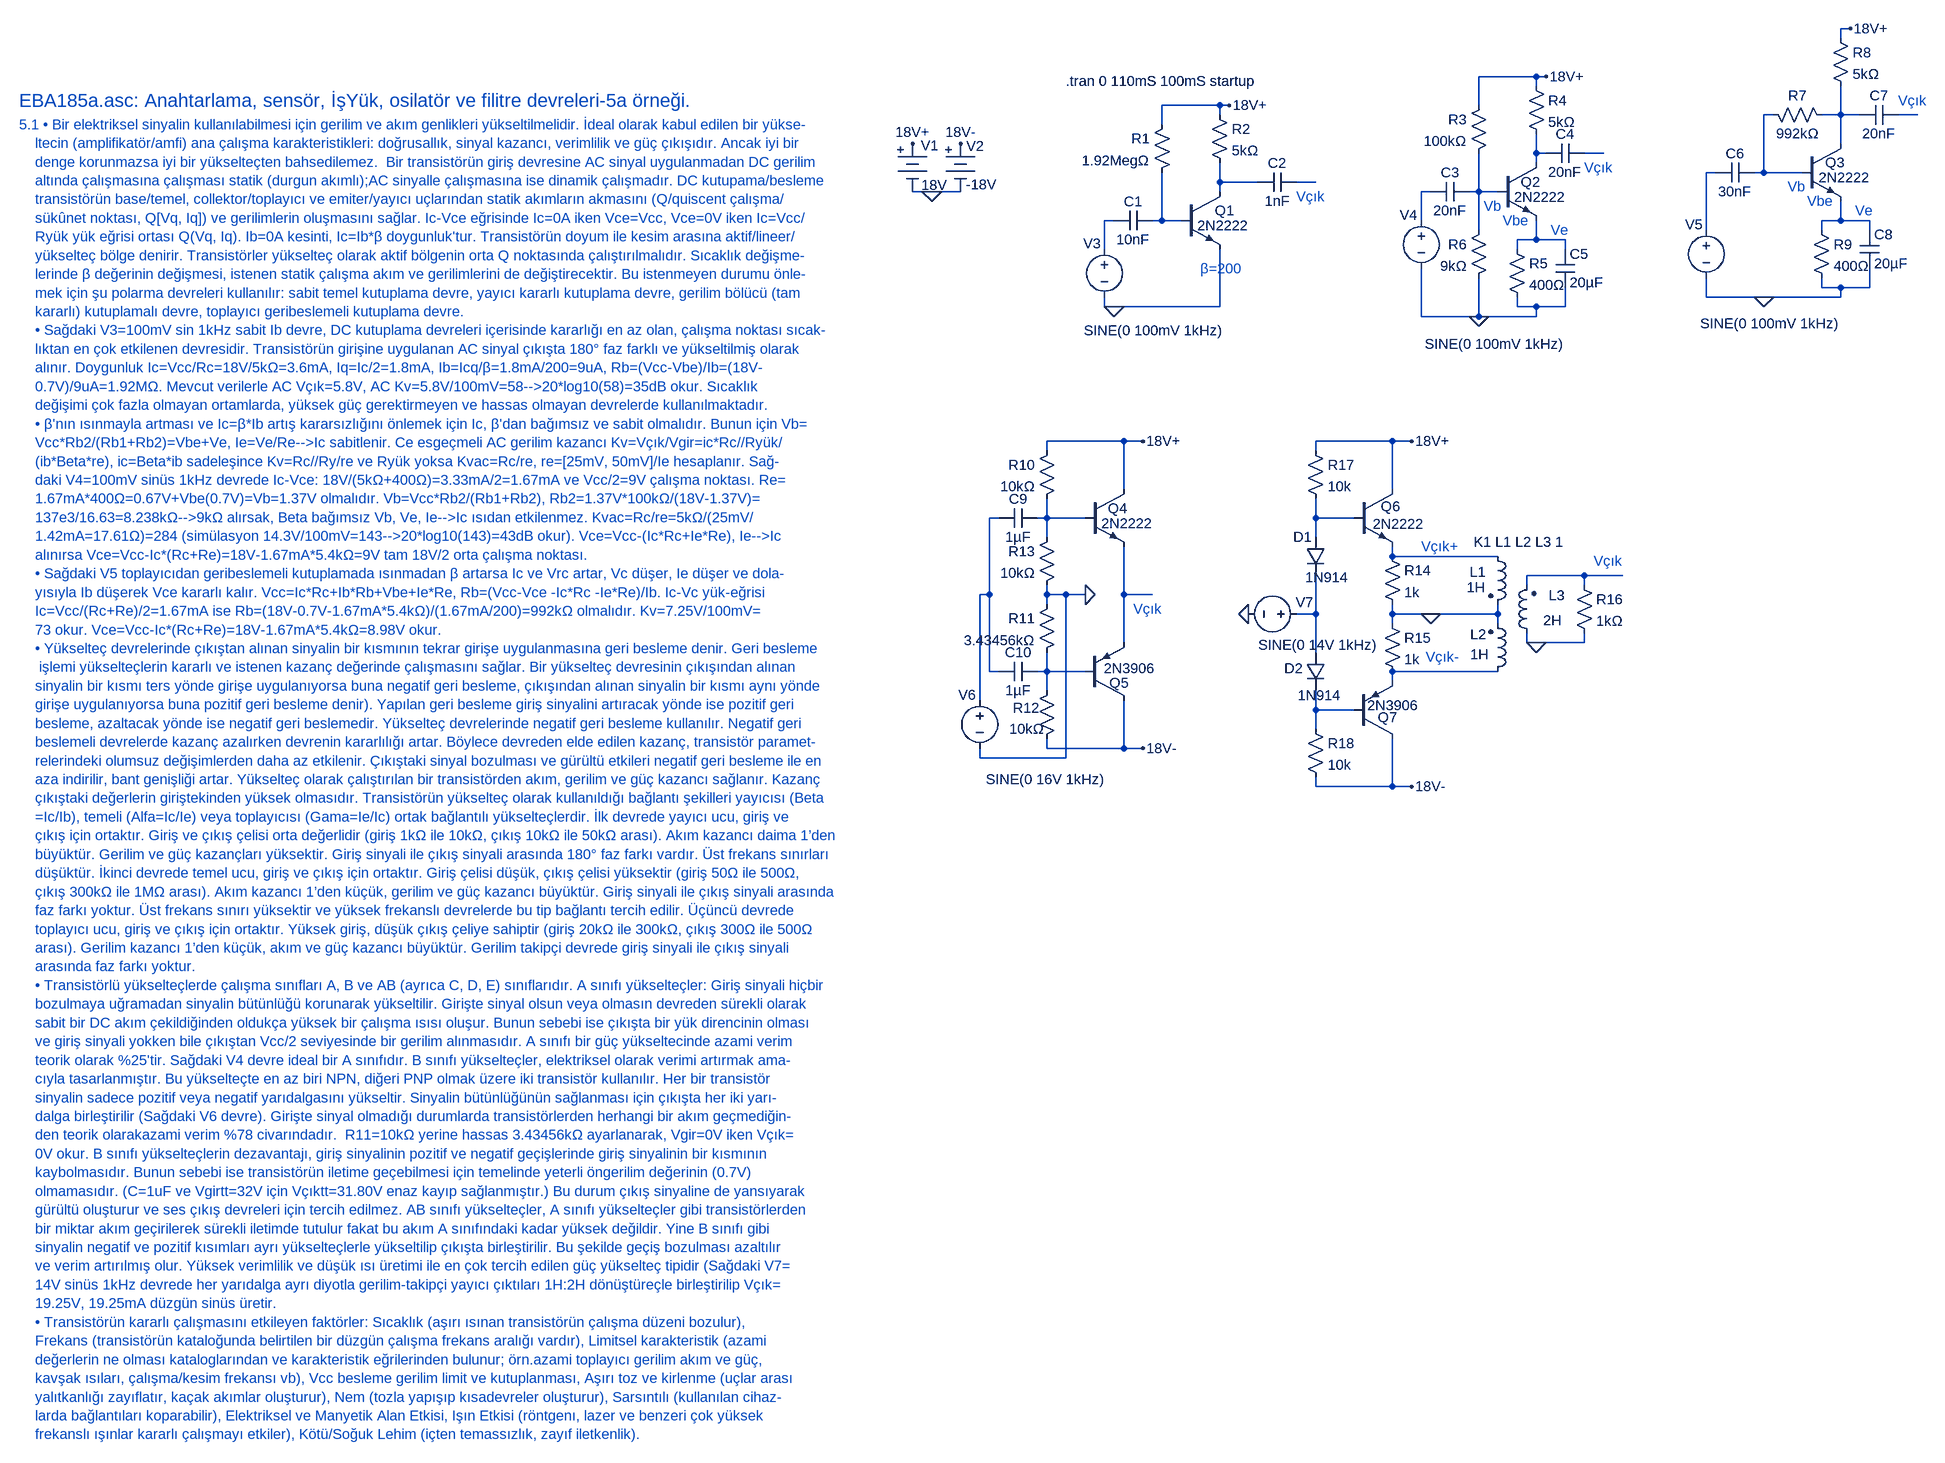
[diagram p0: schematic EBA185a.asc]
EBA185a.asc, the LTspice schematic file:
Version 4
SHEET 1 7064 4332
WIRE 3104 -64 3088 -64
WIRE 3088 -48 3088 -64
WIRE 2544 16 2448 16
WIRE 2560 16 2544 16
WIRE 2544 32 2544 16
WIRE 2016 64 1920 64
WIRE 2032 64 2016 64
WIRE 2448 64 2448 16
WIRE 2016 80 2016 64
WIRE 2976 80 2960 80
WIRE 3088 80 3088 32
WIRE 3088 80 3056 80
WIRE 3120 80 3088 80
WIRE 3216 80 3184 80
WIRE 1920 96 1920 64
WIRE 3088 128 3088 80
WIRE 2544 144 2544 112
WIRE 2560 144 2544 144
WIRE 2656 144 2624 144
WIRE 2544 160 2544 144
WIRE 2880 176 2864 176
WIRE 2960 176 2960 80
WIRE 2960 176 2944 176
WIRE 3024 176 2960 176
WIRE 2016 192 2016 160
WIRE 2080 192 2016 192
WIRE 2176 192 2144 192
WIRE 1536 208 1504 208
WIRE 1584 208 1536 208
WIRE 2016 208 2016 192
WIRE 2368 208 2352 208
WIRE 2448 208 2448 144
WIRE 2448 208 2432 208
WIRE 2480 208 2448 208
WIRE 1840 256 1824 256
WIRE 1920 256 1920 176
WIRE 1920 256 1904 256
WIRE 1952 256 1920 256
WIRE 2352 256 2352 208
WIRE 3088 256 3088 224
WIRE 3088 256 3056 256
WIRE 3136 256 3088 256
WIRE 2448 272 2448 208
WIRE 2864 272 2864 176
WIRE 3056 272 3056 256
WIRE 3136 272 3136 256
WIRE 2544 288 2544 256
WIRE 2544 288 2512 288
WIRE 2592 288 2544 288
WIRE 1824 304 1824 256
WIRE 2512 304 2512 288
WIRE 2592 304 2592 288
WIRE 3056 368 3056 352
WIRE 3088 368 3056 368
WIRE 3136 368 3136 336
WIRE 3136 368 3088 368
WIRE 2864 384 2864 352
WIRE 2960 384 2864 384
WIRE 3088 384 3088 368
WIRE 3088 384 2960 384
WIRE 1824 400 1824 384
WIRE 1840 400 1824 400
WIRE 2016 400 2016 304
WIRE 2016 400 1840 400
WIRE 2512 400 2512 384
WIRE 2544 400 2512 400
WIRE 2592 400 2592 368
WIRE 2592 400 2544 400
WIRE 2352 416 2352 336
WIRE 2448 416 2448 352
WIRE 2448 416 2352 416
WIRE 2544 416 2544 400
WIRE 2544 416 2448 416
WIRE 1856 624 1728 624
WIRE 1888 624 1856 624
WIRE 2304 624 2176 624
WIRE 2336 624 2304 624
WIRE 1728 640 1728 624
WIRE 2176 640 2176 624
WIRE 1856 704 1856 624
WIRE 2304 704 2304 624
WIRE 1648 752 1632 752
WIRE 1728 752 1728 720
WIRE 1728 752 1712 752
WIRE 1792 752 1728 752
WIRE 2176 752 2176 720
WIRE 2240 752 2176 752
WIRE 1728 784 1728 752
WIRE 2176 784 2176 752
WIRE 2304 816 2304 800
WIRE 2480 816 2304 816
WIRE 2624 848 2528 848
WIRE 2688 848 2624 848
WIRE 2528 864 2528 848
WIRE 2624 864 2624 848
WIRE 1632 880 1632 752
WIRE 1632 880 1616 880
WIRE 1728 880 1728 864
WIRE 1760 880 1728 880
WIRE 1792 880 1760 880
WIRE 1856 880 1856 800
WIRE 1904 880 1856 880
WIRE 1728 896 1728 880
WIRE 2176 912 2176 848
WIRE 2176 912 2144 912
WIRE 2304 912 2304 896
WIRE 2368 912 2304 912
WIRE 2480 912 2480 896
WIRE 2480 912 2368 912
WIRE 2304 928 2304 912
WIRE 2480 928 2480 912
WIRE 1856 960 1856 880
WIRE 2528 960 2528 944
WIRE 2544 960 2528 960
WIRE 2624 960 2624 944
WIRE 2624 960 2544 960
WIRE 2176 976 2176 912
WIRE 1632 1008 1632 880
WIRE 1648 1008 1632 1008
WIRE 1728 1008 1728 976
WIRE 1728 1008 1712 1008
WIRE 1792 1008 1728 1008
WIRE 2480 1008 2304 1008
WIRE 2304 1024 2304 1008
WIRE 1728 1040 1728 1008
WIRE 1616 1056 1616 880
WIRE 2176 1072 2176 1040
WIRE 2240 1072 2176 1072
WIRE 2176 1104 2176 1072
WIRE 1728 1136 1728 1120
WIRE 1856 1136 1856 1056
WIRE 1856 1136 1728 1136
WIRE 1888 1136 1856 1136
WIRE 1616 1152 1616 1136
WIRE 1760 1152 1760 880
WIRE 1760 1152 1616 1152
WIRE 2176 1200 2176 1184
WIRE 2304 1200 2304 1120
WIRE 2304 1200 2176 1200
WIRE 2336 1200 2304 1200
FLAG 1536 208 0
FLAG 1504 128 18V+
FLAG 1584 128 18V-
FLAG 2032 64 18V+
FLAG 1840 400 0
FLAG 2560 16 18V+
FLAG 2448 416 0
FLAG 3104 -64 18V+
FLAG 2960 384 0
FLAG 1888 624 18V+
FLAG 1792 880 0
FLAG 1888 1136 18V-
FLAG 2368 912 0
FLAG 2544 960 0
FLAG 2064 912 0
FLAG 2336 624 18V+
FLAG 2336 1200 18V-
SYMBOL Misc\\battery 1504 112 R0
WINDOW 3 15 85 Left 2
WINDOW 0 14 19 Left 2
SYMATTR Value 18V
SYMATTR InstName V1
SYMBOL Misc\\battery 1584 112 R0
WINDOW 3 9 84 Left 2
WINDOW 0 10 20 Left 2
SYMATTR Value -18V
SYMATTR InstName V2
SYMBOL npn 1952 208 R0
WINDOW 3 27 57 Left 2
SYMATTR Value 2N2222
SYMATTR InstName Q1
SYMBOL res 1936 80 M0
SYMATTR InstName R1
SYMATTR Value 1.92MegΩ
SYMBOL res 2000 64 R0
SYMATTR InstName R2
SYMATTR Value 5kΩ
SYMBOL voltage 1824 288 M0
WINDOW 0 6 7 Left 2
WINDOW 3 -196 152 Left 2
WINDOW 123 0 0 Left 0
WINDOW 39 0 0 Left 0
SYMATTR InstName V3
SYMATTR Value SINE(0 100mV 1kHz)
SYMBOL cap 1904 240 R90
WINDOW 0 0 32 VBottom 2
WINDOW 3 32 32 VTop 2
SYMATTR InstName C1
SYMATTR Value 10nF
SYMBOL cap 2144 176 R90
WINDOW 0 0 32 VBottom 2
WINDOW 3 32 32 VTop 2
SYMATTR InstName C2
SYMATTR Value 1nF
SYMBOL npn 2480 160 R0
WINDOW 3 27 57 Left 2
WINDOW 0 38 32 Left 2
SYMATTR Value 2N2222
SYMATTR InstName Q2
SYMBOL res 2464 48 M0
SYMATTR InstName R3
SYMATTR Value 100kΩ
SYMBOL res 2528 16 R0
SYMATTR InstName R4
SYMATTR Value 5kΩ
SYMBOL voltage 2352 240 M0
WINDOW 0 6 7 Left 2
WINDOW 3 -236 222 Left 2
WINDOW 123 0 0 Left 0
WINDOW 39 0 0 Left 0
SYMATTR InstName V4
SYMATTR Value SINE(0 100mV 1kHz)
SYMBOL cap 2432 192 R90
WINDOW 0 0 32 VBottom 2
WINDOW 3 32 32 VTop 2
SYMATTR InstName C3
SYMATTR Value 20nF
SYMBOL cap 2624 128 R90
WINDOW 0 0 32 VBottom 2
WINDOW 3 32 32 VTop 2
SYMATTR InstName C4
SYMATTR Value 20nF
SYMBOL res 2496 288 R0
SYMATTR InstName R5
SYMATTR Value 400Ω
SYMBOL cap 2576 304 R0
SYMATTR InstName C5
SYMATTR Value 20µF
SYMBOL res 2464 256 M0
SYMATTR InstName R6
SYMATTR Value 9kΩ
SYMBOL npn 3024 128 R0
WINDOW 3 27 57 Left 2
WINDOW 0 38 32 Left 2
SYMATTR Value 2N2222
SYMATTR InstName Q3
SYMBOL res 3072 96 M270
WINDOW 0 32 56 VTop 2
WINDOW 3 0 56 VBottom 2
SYMATTR InstName R7
SYMATTR Value 992kΩ
SYMBOL res 3072 -64 R0
SYMATTR InstName R8
SYMATTR Value 5kΩ
SYMBOL voltage 2864 256 M0
WINDOW 0 6 7 Left 2
WINDOW 3 -220 172 Left 2
WINDOW 123 0 0 Left 0
WINDOW 39 0 0 Left 0
SYMATTR InstName V5
SYMATTR Value SINE(0 100mV 1kHz)
SYMBOL cap 2944 160 R90
WINDOW 0 0 32 VBottom 2
WINDOW 3 32 32 VTop 2
SYMATTR InstName C6
SYMATTR Value 30nF
SYMBOL cap 3184 64 R90
WINDOW 0 0 32 VBottom 2
WINDOW 3 32 32 VTop 2
SYMATTR InstName C7
SYMATTR Value 20nF
SYMBOL res 3040 256 R0
SYMATTR InstName R9
SYMATTR Value 400Ω
SYMBOL cap 3120 272 R0
SYMATTR InstName C8
SYMATTR Value 20µF
SYMBOL npn 1792 704 R0
WINDOW 3 27 57 Left 2
WINDOW 0 38 32 Left 2
SYMATTR Value 2N2222
SYMATTR InstName Q4
SYMBOL res 1744 624 M0
SYMATTR InstName R10
SYMATTR Value 10kΩ
SYMBOL voltage 1616 1040 M0
WINDOW 0 6 7 Left 2
WINDOW 3 -207 148 Left 2
WINDOW 123 0 0 Left 0
WINDOW 39 0 0 Left 0
SYMATTR InstName V6
SYMATTR Value SINE(0 16V 1kHz)
SYMBOL cap 1712 736 R90
WINDOW 0 0 32 VBottom 2
WINDOW 3 32 32 VTop 2
SYMATTR InstName C9
SYMATTR Value 1µF
SYMBOL res 1744 768 M0
SYMATTR InstName R13
SYMATTR Value 10kΩ
SYMBOL pnp 1792 1056 M180
WINDOW 0 40 29 Left 2
WINDOW 3 31 53 Left 2
SYMATTR InstName Q5
SYMATTR Value 2N3906
SYMBOL res 1744 880 M0
SYMATTR InstName R11
SYMATTR Value 3.43456kΩ
SYMBOL cap 1712 992 R90
WINDOW 0 0 32 VBottom 2
WINDOW 3 32 32 VTop 2
SYMATTR InstName C10
SYMATTR Value 1µF
SYMBOL res 1744 1024 M0
WINDOW 0 28 45 Left 2
WINDOW 3 21 80 Left 2
SYMATTR InstName R12
SYMATTR Value 10kΩ
SYMBOL npn 2240 704 R0
WINDOW 0 45 29 Left 2
WINDOW 3 31 58 Left 2
SYMATTR InstName Q6
SYMATTR Value 2N2222
SYMBOL pnp 2240 1120 M180
WINDOW 0 40 35 Left 2
WINDOW 3 22 55 Left 2
SYMATTR InstName Q7
SYMATTR Value 2N3906
SYMBOL voltage 2160 912 R90
WINDOW 3 52 -117 VRight 2
WINDOW 123 0 0 Left 0
WINDOW 39 0 0 Left 0
WINDOW 0 -19 -12 VRight 2
SYMATTR Value SINE(0 14V 1kHz)
SYMATTR InstName V7
SYMBOL diode 2192 784 M0
WINDOW 3 -38 67 Left 2
WINDOW 0 22 0 Left 2
SYMATTR Value 1N914
SYMATTR InstName D1
SYMBOL diode 2192 976 M0
WINDOW 3 -26 72 Left 2
WINDOW 0 37 27 Left 2
SYMATTR Value 1N914
SYMATTR InstName D2
SYMBOL res 2288 800 R0
SYMATTR InstName R14
SYMATTR Value 1k
SYMBOL res 2288 912 R0
SYMATTR InstName R15
SYMATTR Value 1k
SYMBOL ind2 2464 800 R0
WINDOW 0 -31 42 Left 2
WINDOW 3 -36 68 Left 2
SYMATTR InstName L1
SYMATTR Value 1H
SYMATTR Type ind
SYMBOL ind2 2464 1024 M180
WINDOW 0 -30 78 Left 2
WINDOW 3 -30 44 Left 2
SYMATTR InstName L2
SYMATTR Value 1H
SYMATTR Type ind
SYMBOL ind2 2544 960 R180
WINDOW 0 -48 79 Left 2
WINDOW 3 -42 37 Left 2
SYMATTR InstName L3
SYMATTR Value 2H
SYMATTR Type ind
SYMBOL res 2608 848 R0
SYMATTR InstName R16
SYMATTR Value 1kΩ
SYMBOL res 2160 624 R0
SYMATTR InstName R17
SYMATTR Value 10k
SYMBOL res 2160 1088 R0
SYMATTR InstName R18
SYMATTR Value 10k
TEXT -232 56 Left 3 ;EBA185a.asc: Anahtarlama, sensör, İşYük, osilatör ve filitre devreleri-5a örneği.
TEXT -232 96 Left 2 ;5.1 • Bir elektriksel sinyalin kullanılabilmesi için gerilim ve akım genlikleri yükseltilmelidir. İdeal olarak kabul edilen bir yükse-\n    ltecin (amplifikatör/amfi) ana çalışma karakteristikleri: doğrusallık, sinyal kazancı, verimlilik ve güç çıkışıdır. Ancak iyi bir\n    denge korunmazsa iyi bir yükselteçten bahsedilemez.  Bir transistörün giriş devresine AC sinyal uygulanmadan DC gerilim\n    altında çalışmasına çalışması statik (durgun akımlı);AC sinyalle çalışmasına ise dinamik çalışmadır. DC kutupama/besleme\n    transistörün base/temel, collektor/toplayıcı ve emiter/yayıcı uçlarından statik akımların akmasını (Q/quiscent çalışma/\n    sükûnet noktası, Q[Vq, Iq]) ve gerilimlerin oluşmasını sağlar. Ic-Vce eğrisinde Ic=0A iken Vce=Vcc, Vce=0V iken Ic=Vcc/\n    Ryük yük eğrisi ortası Q(Vq, Iq). Ib=0A kesinti, Ic=Ib*β doygunluk'tur. Transistörün doyum ile kesim arasına aktif/lineer/\n    yükselteç bölge denirir. Transistörler yükselteç olarak aktif bölgenin orta Q noktasında çalıştırılmalıdır. Sıcaklık değişme-\n    lerinde β değerinin değişmesi, istenen statik çalışma akım ve gerilimlerini de değiştirecektir. Bu istenmeyen durumu önle-\n    mek için şu polarma devreleri kullanılır: sabit temel kutuplama devre, yayıcı kararlı kutuplama devre, gerilim bölücü (tam \n    kararlı) kutuplamalı devre, toplayıcı geribeslemeli kutuplama devre.\n    • Sağdaki V3=100mV sin 1kHz sabit Ib devre, DC kutuplama devreleri içerisinde kararlığı en az olan, çalışma noktası sıcak-\n    lıktan en çok etkilenen devresidir. Transistörün girişine uygulanan AC sinyal çıkışta 180° faz farklı ve yükseltilmiş olarak \n    alınır. Doygunluk Ic=Vcc/Rc=18V/5kΩ=3.6mA, Iq=Ic/2=1.8mA, Ib=Icq/β=1.8mA/200=9uA, Rb=(Vcc-Vbe)/Ib=(18V-\n    0.7V)/9uA=1.92MΩ. Mevcut verilerle AC Vçık=5.8V, AC Kv=5.8V/100mV=58-->20*log10(58)=35dB okur. Sıcaklık \n    değişimi çok fazla olmayan ortamlarda, yüksek güç gerektirmeyen ve hassas olmayan devrelerde kullanılmaktadır.\n    • β'nın ısınmayla artması ve Ic=β*Ib artış kararsızlığını önlemek için Ic, β'dan bağımsız ve sabit olmalıdır. Bunun için Vb=\n    Vcc*Rb2/(Rb1+Rb2)=Vbe+Ve, Ie=Ve/Re-->Ic sabitlenir. Ce esgeçmeli AC gerilim kazancı Kv=Vçık/Vgir=ic*Rc//Ryük/\n    (ib*Beta*re), ic=Beta*ib sadeleşince Kv=Rc//Ry/re ve Ryük yoksa Kvac=Rc/re, re=[25mV, 50mV]/Ie hesaplanır. Sağ-\n    daki V4=100mV sinüs 1kHz devrede Ic-Vce: 18V/(5kΩ+400Ω)=3.33mA/2=1.67mA ve Vcc/2=9V çalışma noktası. Re=\n    1.67mA*400Ω=0.67V+Vbe(0.7V)=Vb=1.37V olmalıdır. Vb=Vcc*Rb2/(Rb1+Rb2), Rb2=1.37V*100kΩ/(18V-1.37V)=\n    137e3/16.63=8.238kΩ-->9kΩ alırsak, Beta bağımsız Vb, Ve, Ie-->Ic ısıdan etkilenmez. Kvac=Rc/re=5kΩ/(25mV/\n    1.42mA=17.61Ω)=284 (simülasyon 14.3V/100mV=143-->20*log10(143)=43dB okur). Vce=Vcc-(Ic*Rc+Ie*Re), Ie-->Ic\n    alınırsa Vce=Vcc-Ic*(Rc+Re)=18V-1.67mA*5.4kΩ=9V tam 18V/2 orta çalışma noktası.\n    • Sağdaki V5 toplayıcıdan geribeslemeli kutuplamada ısınmadan β artarsa Ic ve Vrc artar, Vc düşer, Ie düşer ve dola-\n    yısıyla Ib düşerek Vce kararlı kalır. Vcc=Ic*Rc+Ib*Rb+Vbe+Ie*Re, Rb=(Vcc-Vce -Ic*Rc -Ie*Re)/Ib. Ic-Vc yük-eğrisi \n    Ic=Vcc/(Rc+Re)/2=1.67mA ise Rb=(18V-0.7V-1.67mA*5.4kΩ)/(1.67mA/200)=992kΩ olmalıdır. Kv=7.25V/100mV=\n    73 okur. Vce=Vcc-Ic*(Rc+Re)=18V-1.67mA*5.4kΩ=8.98V okur.\n    • Yükselteç devrelerinde çıkıştan alınan sinyalin bir kısmının tekrar girişe uygulanmasına geri besleme denir. Geri besleme\n     işlemi yükselteçlerin kararlı ve istenen kazanç değerinde çalışmasını sağlar. Bir yükselteç devresinin çıkışından alınan \n    sinyalin bir kısmı ters yönde girişe uygulanıyorsa buna negatif geri besleme, çıkışından alınan sinyalin bir kısmı aynı yönde\n    girişe uygulanıyorsa buna pozitif geri besleme denir). Yapılan geri besleme giriş sinyalini artıracak yönde ise pozitif geri\n    besleme, azaltacak yönde ise negatif geri beslemedir. Yükselteç devrelerinde negatif geri besleme kullanılır. Negatif geri \n    beslemeli devrelerde kazanç azalırken devrenin kararlılığı artar. Böylece devreden elde edilen kazanç, transistör paramet-\n    relerindeki olumsuz değişimlerden daha az etkilenir. Çıkıştaki sinyal bozulması ve gürültü etkileri negatif geri besleme ile en \n    aza indirilir, bant genişliği artar. Yükselteç olarak çalıştırılan bir transistörden akım, gerilim ve güç kazancı sağlanır. Kazanç \n    çıkıştaki değerlerin giriştekinden yüksek olmasıdır. Transistörün yükselteç olarak kullanıldığı bağlantı şekilleri yayıcısı (Beta\n    =Ic/Ib), temeli (Alfa=Ic/Ie) veya toplayıcısı (Gama=Ie/Ic) ortak bağlantılı yükselteçlerdir. İlk devrede yayıcı ucu, giriş ve \n    çıkış için ortaktır. Giriş ve çıkış çelisi orta değerlidir (giriş 1kΩ ile 10kΩ, çıkış 10kΩ ile 50kΩ arası). Akım kazancı daima 1’den\n    büyüktür. Gerilim ve güç kazançları yüksektir. Giriş sinyali ile çıkış sinyali arasında 180° faz farkı vardır. Üst frekans sınırları \n    düşüktür. İkinci devrede temel ucu, giriş ve çıkış için ortaktır. Giriş çelisi düşük, çıkış çelisi yüksektir (giriş 50Ω ile 500Ω, \n    çıkış 300kΩ ile 1MΩ arası). Akım kazancı 1’den küçük, gerilim ve güç kazancı büyüktür. Giriş sinyali ile çıkış sinyali arasında \n    faz farkı yoktur. Üst frekans sınırı yüksektir ve yüksek frekanslı devrelerde bu tip bağlantı tercih edilir. Üçüncü devrede \n    toplayıcı ucu, giriş ve çıkış için ortaktır. Yüksek giriş, düşük çıkış çeliye sahiptir (giriş 20kΩ ile 300kΩ, çıkış 300Ω ile 500Ω \n    arası). Gerilim kazancı 1’den küçük, akım ve güç kazancı büyüktür. Gerilim takipçi devrede giriş sinyali ile çıkış sinyali\n    arasında faz farkı yoktur.\n    • Transistörlü yükselteçlerde çalışma sınıfları A, B ve AB (ayrıca C, D, E) sınıflarıdır. A sınıfı yükselteçler: Giriş sinyali hiçbir \n    bozulmaya uğramadan sinyalin bütünlüğü korunarak yükseltilir. Girişte sinyal olsun veya olmasın devreden sürekli olarak \n    sabit bir DC akım çekildiğinden oldukça yüksek bir çalışma ısısı oluşur. Bunun sebebi ise çıkışta bir yük direncinin olması\n    ve giriş sinyali yokken bile çıkıştan Vcc/2 seviyesinde bir gerilim alınmasıdır. A sınıfı bir güç yükseltecinde azami verim \n    teorik olarak %25'tir. Sağdaki V4 devre ideal bir A sınıfıdır. B sınıfı yükselteçler, elektriksel olarak verimi artırmak ama-\n    cıyla tasarlanmıştır. Bu yükselteçte en az biri NPN, diğeri PNP olmak üzere iki transistör kullanılır. Her bir transistör \n    sinyalin sadece pozitif veya negatif yarıdalgasını yükseltir. Sinyalin bütünlüğünün sağlanması için çıkışta her iki yarı-\n    dalga birleştirilir (Sağdaki V6 devre). Girişte sinyal olmadığı durumlarda transistörlerden herhangi bir akım geçmediğin-\n    den teorik olarakazami verim %78 civarındadır.  R11=10kΩ yerine hassas 3.43456kΩ ayarlanarak, Vgir=0V iken Vçık=\n    0V okur. B sınıfı yükselteçlerin dezavantajı, giriş sinyalinin pozitif ve negatif geçişlerinde giriş sinyalinin bir kısmının \n    kaybolmasıdır. Bunun sebebi ise transistörün iletime geçebilmesi için temelinde yeterli öngerilim değerinin (0.7V) \n    olmamasıdır. (C=1uF ve Vgirtt=32V için Vçıktt=31.80V enaz kayıp sağlanmıştır.) Bu durum çıkış sinyaline de yansıyarak \n    gürültü oluşturur ve ses çıkış devreleri için tercih edilmez. AB sınıfı yükselteçler, A sınıfı yükselteçler gibi transistörlerden \n    bir miktar akım geçirilerek sürekli iletimde tutulur fakat bu akım A sınıfındaki kadar yüksek değildir. Yine B sınıfı gibi\n    sinyalin negatif ve pozitif kısımları ayrı yükselteçlerle yükseltilip çıkışta birleştirilir. Bu şekilde geçiş bozulması azaltılır \n    ve verim artırılmış olur. Yüksek verimlilik ve düşük ısı üretimi ile en çok tercih edilen güç yükselteç tipidir (Sağdaki V7=\n    14V sinüs 1kHz devrede her yarıdalga ayrı diyotla gerilim-takipçi yayıcı çıktıları 1H:2H dönüştüreçle birleştirilip Vçık=\n    19.25V, 19.25mA düzgün sinüs üretir.\n    • Transistörün kararlı çalışmasını etkileyen faktörler: Sıcaklık (aşırı ısınan transistörün çalışma düzeni bozulur), \n    Frekans (transistörün kataloğunda belirtilen bir düzgün çalışma frekans aralığı vardır), Limitsel karakteristik (azami \n    değerlerin ne olması kataloglarından ve karakteristik eğrilerinden bulunur; örn.azami toplayıcı gerilim akım ve güç, \n    kavşak ısıları, çalışma/kesim frekansı vb), Vcc besleme gerilim limit ve kutuplanması, Aşırı toz ve kirlenme (uçlar arası\n    yalıtkanlığı zayıflatır, kaçak akımlar oluşturur), Nem (tozla yapışıp kısadevreler oluşturur), Sarsıntılı (kullanılan cihaz-\n    larda bağlantıları koparabilir), Elektriksel ve Manyetik Alan Etkisi, Işın Etkisi (röntgenı, lazer ve benzeri çok yüksek \n    frekanslı ışınlar kararlı çalışmayı etkiler), Kötü/Soğuk Lehim (içten temassızlık, zayıf iletkenlik).
TEXT 1984 336 Left 2 ;β=200
TEXT 1760 24 Left 2 !.tran 0 110mS 100mS startup
TEXT 2144 216 Left 2 ;Vçık
TEXT 2624 168 Left 2 ;Vçık
TEXT 2456 232 Left 2 ;Vb
TEXT 2568 272 Left 2 ;Ve
TEXT 2488 256 Left 2 ;Vbe
TEXT 3184 56 Left 2 ;Vçık
TEXT 3000 200 Left 2 ;Vb
TEXT 3112 240 Left 2 ;Ve
TEXT 3032 224 Left 2 ;Vbe
TEXT 1872 904 Left 2 ;Vçık
TEXT 2640 824 Left 2 ;Vçık
TEXT 2440 792 Left 2 !K1 L1 L2 L3 1
TEXT 2352 800 Left 2 ;Vçık+
TEXT 2360 984 Left 2 ;Vçık-

The netlist it stands for:
* EBA185a.asc
V1 18V+ 0 18V
V2 18V- 0 -18V
Q1 N007 N012 0 0 2N2222
R1 18V+ N012 1.92MegΩ
R2 18V+ N007 5kΩ
V3 N011 0 SINE(0 100mV 1kHz)
C1 N012 N011 10nF
C2 N008 N007 1nF
Q2 N004 N010 N014 0 2N2222
R3 18V+ N010 100kΩ
R4 18V+ N004 5kΩ
V4 N009 0 SINE(0 100mV 1kHz)
C3 N010 N009 20nF
C4 N005 N004 20nF
R5 N014 0 400Ω
C5 N014 0 20µF
R6 N010 0 9kΩ
Q3 N002 N001 N013 0 2N2222
R7 N002 N001 992kΩ
R8 18V+ N002 5kΩ
V5 N006 0 SINE(0 100mV 1kHz)
C6 N001 N006 30nF
C7 N003 N002 20nF
R9 N013 0 400Ω
C8 N013 0 20µF
Q4 18V+ N016 N020 0 2N2222
R10 18V+ N016 10kΩ
V6 N015 0 SINE(0 16V 1kHz)
C9 N016 N015 1µF
R13 N016 0 10kΩ
Q5 18V- N022 N020 0 2N3906
R11 0 N022 3.43456kΩ
C10 N022 N015 1µF
R12 N022 18V- 10kΩ
Q6 18V+ N017 N018 0 2N2222
Q7 18V- N024 N023 0 2N3906
V7 N021 0 SINE(0 14V 1kHz)
D1 N017 N021 1N914
D2 N021 N024 1N914
R14 N018 0 1k
R15 0 N023 1k
L1 N018 0 1H
L2 N023 0 1H
L3 0 N019 2H
R16 N019 0 1kΩ
R17 18V+ N017 10k
R18 N024 18V- 10k
.model D D
.lib standard.dio
.model NPN NPN
.model PNP PNP
.lib standard.bjt
* EBA185a.asc: Anahtarlama, sensör, İşYük, osilatör ve filitre devreleri-5a örneği.
* 5.1 • Bir elektriksel sinyalin kullanılabilmesi için gerilim ve akım genlikleri yükseltilmelidir. İdeal olarak kabul edilen bir yükse-
*     ltecin (amplifikatör/amfi) ana çalışma karakteristikleri: doğrusallık, sinyal kazancı, verimlilik ve güç çıkışıdır. Ancak iyi bir
*     denge korunmazsa iyi bir yükselteçten bahsedilemez.  Bir transistörün giriş devresine AC sinyal uygulanmadan DC gerilim
*     altında çalışmasına çalışması statik (durgun akımlı);AC sinyalle çalışmasına ise dinamik çalışmadır. DC kutupama/besleme
*     transistörün base/temel, collektor/toplayıcı ve emiter/yayıcı uçlarından statik akımların akmasını (Q/quiscent çalışma/
*     sükûnet noktası, Q[Vq, Iq]) ve gerilimlerin oluşmasını sağlar. Ic-Vce eğrisinde Ic=0A iken Vce=Vcc, Vce=0V iken Ic=Vcc/
*     Ryük yük eğrisi ortası Q(Vq, Iq). Ib=0A kesinti, Ic=Ib*β doygunluk'tur. Transistörün doyum ile kesim arasına aktif/lineer/
*     yükselteç bölge denirir. Transistörler yükselteç olarak aktif bölgenin orta Q noktasında çalıştırılmalıdır. Sıcaklık değişme-
*     lerinde β değerinin değişmesi, istenen statik çalışma akım ve gerilimlerini de değiştirecektir. Bu istenmeyen durumu önle-
*     mek için şu polarma devreleri kullanılır: sabit temel kutuplama devre, yayıcı kararlı kutuplama devre, gerilim bölücü (tam
*     kararlı) kutuplamalı devre, toplayıcı geribeslemeli kutuplama devre.
*     • Sağdaki V3=100mV sin 1kHz sabit Ib devre, DC kutuplama devreleri içerisinde kararlığı en az olan, çalışma noktası sıcak-
*     lıktan en çok etkilenen devresidir. Transistörün girişine uygulanan AC sinyal çıkışta 180° faz farklı ve yükseltilmiş olarak
*     alınır. Doygunluk Ic=Vcc/Rc=18V/5kΩ=3.6mA, Iq=Ic/2=1.8mA, Ib=Icq/β=1.8mA/200=9uA, Rb=(Vcc-Vbe)/Ib=(18V-
*     0.7V)/9uA=1.92MΩ. Mevcut verilerle AC Vçık=5.8V, AC Kv=5.8V/100mV=58-->20*log10(58)=35dB okur. Sıcaklık
*     değişimi çok fazla olmayan ortamlarda, yüksek güç gerektirmeyen ve hassas olmayan devrelerde kullanılmaktadır.
*     • β'nın ısınmayla artması ve Ic=β*Ib artış kararsızlığını önlemek için Ic, β'dan bağımsız ve sabit olmalıdır. Bunun için Vb=
*     Vcc*Rb2/(Rb1+Rb2)=Vbe+Ve, Ie=Ve/Re-->Ic sabitlenir. Ce esgeçmeli AC gerilim kazancı Kv=Vçık/Vgir=ic*Rc//Ryük/
*     (ib*Beta*re), ic=Beta*ib sadeleşince Kv=Rc//Ry/re ve Ryük yoksa Kvac=Rc/re, re=[25mV, 50mV]/Ie hesaplanır. Sağ-
*     daki V4=100mV sinüs 1kHz devrede Ic-Vce: 18V/(5kΩ+400Ω)=3.33mA/2=1.67mA ve Vcc/2=9V çalışma noktası. Re=
*     1.67mA*400Ω=0.67V+Vbe(0.7V)=Vb=1.37V olmalıdır. Vb=Vcc*Rb2/(Rb1+Rb2), Rb2=1.37V*100kΩ/(18V-1.37V)=
*     137e3/16.63=8.238kΩ-->9kΩ alırsak, Beta bağımsız Vb, Ve, Ie-->Ic ısıdan etkilenmez. Kvac=Rc/re=5kΩ/(25mV/
*     1.42mA=17.61Ω)=284 (simülasyon 14.3V/100mV=143-->20*log10(143)=43dB okur). Vce=Vcc-(Ic*Rc+Ie*Re), Ie-->Ic
*     alınırsa Vce=Vcc-Ic*(Rc+Re)=18V-1.67mA*5.4kΩ=9V tam 18V/2 orta çalışma noktası.
*     • Sağdaki V5 toplayıcıdan geribeslemeli kutuplamada ısınmadan β artarsa Ic ve Vrc artar, Vc düşer, Ie düşer ve dola-
*     yısıyla Ib düşerek Vce kararlı kalır. Vcc=Ic*Rc+Ib*Rb+Vbe+Ie*Re, Rb=(Vcc-Vce -Ic*Rc -Ie*Re)/Ib. Ic-Vc yük-eğrisi
*     Ic=Vcc/(Rc+Re)/2=1.67mA ise Rb=(18V-0.7V-1.67mA*5.4kΩ)/(1.67mA/200)=992kΩ olmalıdır. Kv=7.25V/100mV=
*     73 okur. Vce=Vcc-Ic*(Rc+Re)=18V-1.67mA*5.4kΩ=8.98V okur.
*     • Yükselteç devrelerinde çıkıştan alınan sinyalin bir kısmının tekrar girişe uygulanmasına geri besleme denir. Geri besleme
*      işlemi yükselteçlerin kararlı ve istenen kazanç değerinde çalışmasını sağlar. Bir yükselteç devresinin çıkışından alınan
*     sinyalin bir kısmı ters yönde girişe uygulanıyorsa buna negatif geri besleme, çıkışından alınan sinyalin bir kısmı aynı yönde
*     girişe uygulanıyorsa buna pozitif geri besleme denir). Yapılan geri besleme giriş sinyalini artıracak yönde ise pozitif geri
*     besleme, azaltacak yönde ise negatif geri beslemedir. Yükselteç devrelerinde negatif geri besleme kullanılır. Negatif geri
*     beslemeli devrelerde kazanç azalırken devrenin kararlılığı artar. Böylece devreden elde edilen kazanç, transistör paramet-
*     relerindeki olumsuz değişimlerden daha az etkilenir. Çıkıştaki sinyal bozulması ve gürültü etkileri negatif geri besleme ile en
*     aza indirilir, bant genişliği artar. Yükselteç olarak çalıştırılan bir transistörden akım, gerilim ve güç kazancı sağlanır. Kazanç
*     çıkıştaki değerlerin giriştekinden yüksek olmasıdır. Transistörün yükselteç olarak kullanıldığı bağlantı şekilleri yayıcısı (Beta
*     =Ic/Ib), temeli (Alfa=Ic/Ie) veya toplayıcısı (Gama=Ie/Ic) ortak bağlantılı yükselteçlerdir. İlk devrede yayıcı ucu, giriş ve
*     çıkış için ortaktır. Giriş ve çıkış çelisi orta değerlidir (giriş 1kΩ ile 10kΩ, çıkış 10kΩ ile 50kΩ arası). Akım kazancı daima 1’den
*     büyüktür. Gerilim ve güç kazançları yüksektir. Giriş sinyali ile çıkış sinyali arasında 180° faz farkı vardır. Üst frekans sınırları
*     düşüktür. İkinci devrede temel ucu, giriş ve çıkış için ortaktır. Giriş çelisi düşük, çıkış çelisi yüksektir (giriş 50Ω ile 500Ω,
*     çıkış 300kΩ ile 1MΩ arası). Akım kazancı 1’den küçük, gerilim ve güç kazancı büyüktür. Giriş sinyali ile çıkış sinyali arasında
*     faz farkı yoktur. Üst frekans sınırı yüksektir ve yüksek frekanslı devrelerde bu tip bağlantı tercih edilir. Üçüncü devrede
*     toplayıcı ucu, giriş ve çıkış için ortaktır. Yüksek giriş, düşük çıkış çeliye sahiptir (giriş 20kΩ ile 300kΩ, çıkış 300Ω ile 500Ω
*     arası). Gerilim kazancı 1’den küçük, akım ve güç kazancı büyüktür. Gerilim takipçi devrede giriş sinyali ile çıkış sinyali
*     arasında faz farkı yoktur.
*     • Transistörlü yükselteçlerde çalışma sınıfları A, B ve AB (ayrıca C, D, E) sınıflarıdır. A sınıfı yükselteçler: Giriş sinyali hiçbir
*     bozulmaya uğramadan sinyalin bütünlüğü korunarak yükseltilir. Girişte sinyal olsun veya olmasın devreden sürekli olarak
*     sabit bir DC akım çekildiğinden oldukça yüksek bir çalışma ısısı oluşur. Bunun sebebi ise çıkışta bir yük direncinin olması
*     ve giriş sinyali yokken bile çıkıştan Vcc/2 seviyesinde bir gerilim alınmasıdır. A sınıfı bir güç yükseltecinde azami verim
*     teorik olarak %25'tir. Sağdaki V4 devre ideal bir A sınıfıdır. B sınıfı yükselteçler, elektriksel olarak verimi artırmak ama-
*     cıyla tasarlanmıştır. Bu yükselteçte en az biri NPN, diğeri PNP olmak üzere iki transistör kullanılır. Her bir transistör
*     sinyalin sadece pozitif veya negatif yarıdalgasını yükseltir. Sinyalin bütünlüğünün sağlanması için çıkışta her iki yarı-
*     dalga birleştirilir (Sağdaki V6 devre). Girişte sinyal olmadığı durumlarda transistörlerden herhangi bir akım geçmediğin-
*     den teorik olarakazami verim %78 civarındadır.  R11=10kΩ yerine hassas 3.43456kΩ ayarlanarak, Vgir=0V iken Vçık=
*     0V okur. B sınıfı yükselteçlerin dezavantajı, giriş sinyalinin pozitif ve negatif geçişlerinde giriş sinyalinin bir kısmının
*     kaybolmasıdır. Bunun sebebi ise transistörün iletime geçebilmesi için temelinde yeterli öngerilim değerinin (0.7V)
*     olmamasıdır. (C=1uF ve Vgirtt=32V için Vçıktt=31.80V enaz kayıp sağlanmıştır.) Bu durum çıkış sinyaline de yansıyarak
*     gürültü oluşturur ve ses çıkış devreleri için tercih edilmez. AB sınıfı yükselteçler, A sınıfı yükselteçler gibi transistörlerden
*     bir miktar akım geçirilerek sürekli iletimde tutulur fakat bu akım A sınıfındaki kadar yüksek değildir. Yine B sınıfı gibi
*     sinyalin negatif ve pozitif kısımları ayrı yükselteçlerle yükseltilip çıkışta birleştirilir. Bu şekilde geçiş bozulması azaltılır
*     ve verim artırılmış olur. Yüksek verimlilik ve düşük ısı üretimi ile en çok tercih edilen güç yükselteç tipidir (Sağdaki V7=
*     14V sinüs 1kHz devrede her yarıdalga ayrı diyotla gerilim-takipçi yayıcı çıktıları 1H:2H dönüştüreçle birleştirilip Vçık=
*     19.25V, 19.25mA düzgün sinüs üretir.
*     • Transistörün kararlı çalışmasını etkileyen faktörler: Sıcaklık (aşırı ısınan transistörün çalışma düzeni bozulur),
*     Frekans (transistörün kataloğunda belirtilen bir düzgün çalışma frekans aralığı vardır), Limitsel karakteristik (azami
*     değerlerin ne olması kataloglarından ve karakteristik eğrilerinden bulunur; örn.azami toplayıcı gerilim akım ve güç,
*     kavşak ısıları, çalışma/kesim frekansı vb), Vcc besleme gerilim limit ve kutuplanması, Aşırı toz ve kirlenme (uçlar arası
*     yalıtkanlığı zayıflatır, kaçak akımlar oluşturur), Nem (tozla yapışıp kısadevreler oluşturur), Sarsıntılı (kullanılan cihaz-
*     larda bağlantıları koparabilir), Elektriksel ve Manyetik Alan Etkisi, Işın Etkisi (röntgenı, lazer ve benzeri çok yüksek
*     frekanslı ışınlar kararlı çalışmayı etkiler), Kötü/Soğuk Lehim (içten temassızlık, zayıf iletkenlik).
* β=200
.tran 0 110mS 100mS startup
* Vçık
* Vçık
* Vb
* Ve
* Vbe
* Vçık
* Vb
* Ve
* Vbe
* Vçık
* Vçık
K1 L1 L2 L3 1
* Vçık+
* Vçık-
.backanno
.end